# EAGLE schematic CapacitiveSoilMoistureSensor_v14 (EAGLE 9.7.0)
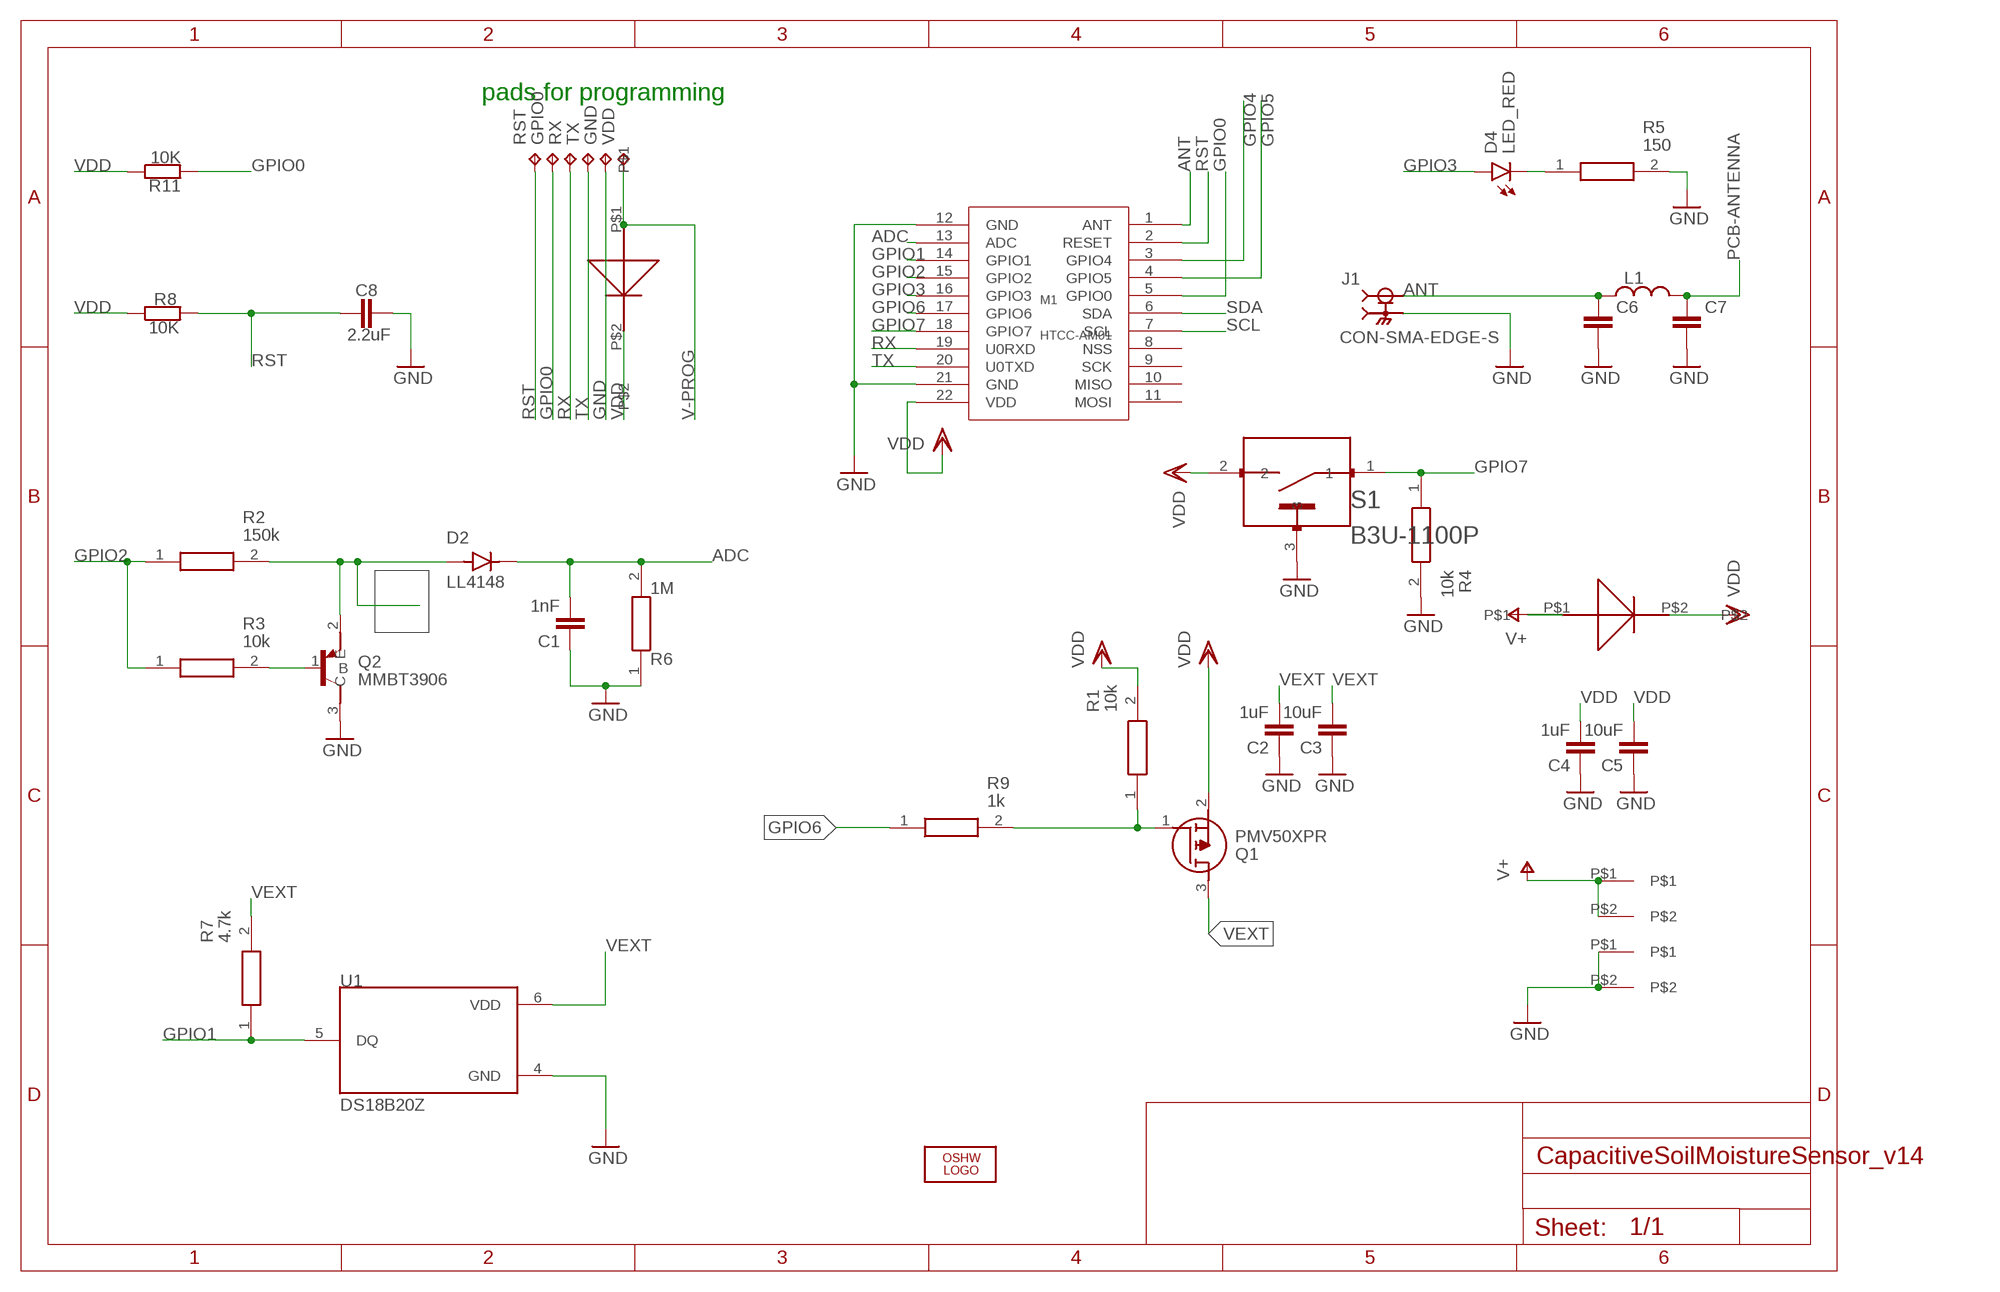
[diagram p0: schematic, sheet 1]

## Parts
C1  1nF  C-EUC0603  [C0603]
C2  1uF  C-EUC0603  [C0603]
C3  10uF  C-EUC0603  [C0603]
C4  1uF  C-EUC0603  [C0603]
C5  10uF  C-EUC0603  [C0603]
C6  C_CHIP-0603(1608-METRIC)  [CAPC1608X85]
C7  C_CHIP-0603(1608-METRIC)  [CAPC1608X85]
C8  2.2uF  C-EUC0603  [C0603]
D1  SOD-323  [SOD-323]
D2  LL4148  [DIO_LL4148]
D3  SOD-323  [SOD-323]
D4  LED_RED  CHIP-FLAT-R_0603-0.80MM  [LEDC1608X80N_FLAT-R]
GND  TPTP20SQ  [TP20SQ]
GPIO0  TPTP20SQ  [TP20SQ]
J1  CON-SMA-EDGE-S  [RFSOLUTIONS_CON-SMA-EDGE-S]
L1  L_CHIP-0603(1608-METRIC)  [INDC1608X95N]
LOGO1  LOGO-OSHW-FILLX0200-NT  [OSHW_FILLX200_NOTEXT]
M1  HTCC-AM01  [HTCC-AM01]
Q1  PMV50XPR  [SOT95P230X110-3N]
Q2  MMBT3906  [SOT95P240X120-3N]
R1  10k  CMP0603AFX-1002ELF  [RESC1608X55N]
R2  150k  RCA06031K00FKEAHP  [RESC1608X55N]
R3  10k  RCA06031K00FKEAHP  [RESC1608X55N]
R4  10k  CMP0603AFX-1002ELF  [RESC1608X55N]
R5  150  RCA06031K00FKEAHP  [RESC1608X55N]
R6  1M  CMP0603AFX-1002ELF  [RESC1608X55N]
R7  4.7k  CMP0603AFX-1002ELF  [RESC1608X55N]
R8  10K  R-EU_R0603  [R0603]
R9  1k  RCA06031K00FKEAHP  [RESC1608X55N]
R11  10K  R-EU_R0603  [R0603]
RST  TPTP20SQ  [TP20SQ]
RX  TPTP20SQ  [TP20SQ]
S1  B3U-1100P  [SW_B3U-1100P]
TX  TPTP20SQ  [TP20SQ]
U1  DS18B20Z  [SOIC127P600X175-8N]
U$3  KEYSTONE53  [KEYSTONE53]
U$4  KEYSTONE53  [KEYSTONE53]
VDD  TPTP20SQ  [TP20SQ]

## Nets
ADC: C1.2 D2.C M1.13(ADC) R6.2
ANT: C6.1 J1.1 L1.1 M1.1(ANT)
GND: C1.1 C2.1 C3.1 C4.1 C5.1 C6.2 C7.2 C8.1 GND.TP J1.G1 J1.G2 J1.G3 J1.G4 M1.12(GND) M1.21(GND) Q2.3(C) R4.2 R5.2 R6.1 S1.3 U1.4(GND) U$4.P$1 U$4.P$2
GPIO0: GPIO0.TP M1.5(GPIO0) R11.2
GPIO1: M1.14(GPIO1) R7.1 U1.5(DQ)
GPIO2: M1.15(GPIO2) R2.1 R3.1
GPIO3: D4.A M1.16(GPIO3)
GPIO4: M1.3(GPIO4)
GPIO5: M1.4(GPIO5)
GPIO6: M1.17(GPIO6) R9.1
GPIO7: M1.18(GPIO7) R4.1 S1.1
N$1: Q1.1(G) R1.1 R9.2
N$3: Q2.1(B) R3.2
N$4: D4.C R5.1
N$5: D2.A Q2.2(E) R2.2
PCB-ANTENNA: C7.1 L1.2
RST: C8.2 M1.2(RESET) R8.2 RST.TP
RX: M1.19(U0RXD) RX.TP
SCL: M1.7(SCL)
SDA: M1.6(SDA)
TX: M1.20(U0TXD) TX.TP
V+: D1.P$1 U$3.P$1 U$3.P$2
V-PROG: D3.P$1 VDD.TP
VDD: C4.2 C5.2 D1.P$2 D3.P$2 M1.22(VDD) Q1.2(S) R1.2 R8.1 R11.1 S1.2
VEXT: C2.2 C3.2 Q1.3(D) R7.2 U1.6(VDD)
Unconnected: M1.8(NSS) M1.9(SCK) M1.10(MISO) M1.11(MOSI)

## Notes on the sheet
- pads for programming

## Library data of the parts
C1-C5 C8 = rcl:C-EU: CAPACITOR, European symbol; SPICEPREFIX: C
C6 C7 = Capacitor:C: Capacitor - Generic; CATEGORY: Capacitor
D1 D3 = HTCC-AM01:SOD-323
D2 = SnapEDA Library:LL4148: Surface Mount Switching Glass; MANUFACTURER: On Semiconductor; MAXIMUM_PACKAGE_HEIGHT: 1.5mm; PARTREV: 1.8; STANDARD: Manufacturer recommendations
D4 = LED:CHIP-FLAT-R; CATEGORY: LED; COLOR: RED; DESCRIPTION: CHIP LED FLAT; SUB-CATEGORY: CHIP; TYPE: FLAT_TOP
GND GPIO0 RST RX TX VDD = testpad:TP: Test pad
J1 = CON-SMA-EDGE-S:CON-SMA-EDGE-S; MANUFACTURER: RF Solutions; MAXIMUM_PACKAGE_HEIGHT: 6.35mm; PARTREV: 1; STANDARD: Manufacturer Recommendations
L1 = Inductor:L: Inductor Fixed - Generic; CATEGORY: Inductor; SUB-CATEGORY: Fixed
LOGO1 = logo:LOGO-OSHW-FILL; PARTNO: DNP
M1 = HTCC-AM01:HTCC-AM01: No description set
Q1 = HTCC-AM01:PMV50XPR: NEXPERIA - PMV50XPR - MOSFET, P-CH, -20V, -3.6A, TO236AB-3 Source: Datasheet <http://assets.nexperia.com/documents/data-sheet/PMV50XP.pdf>; DESCRIPTION: NEXPERIA - PMV50XPR - MOSFET, P-CH, -20V, -3.6A, TO236AB-3; HEIGHT: 1.1mm; MANUFACTURER_NAME: Nexperia; MANUFACTURER_PART_NUMBER: PMV50XPR; MOUSER_PART_NUMBER: 771-PMV50XPR; MOUSER_PRICE-STOCK: https://www.mouser.co.uk/ProductDetail/Nexperia/PMV50XPR?qs=%252BRKXB2WKlSc7VldGLKM90g%3D%3D
Q2 = SnapEDA Library:MMBT3906: MMBT3906 Series 40 V CE Breakdown 0.2 A PNP General Purpose Amplifier - SOT-23; MANUFACTURER: Fairchild Semiconductor
R1 R4 R6 R7 = HTCC-AM01:CMP0603AFX-1002ELF: Thick Film Resistors - SMD 10K OHM 1% 1/4W TC100 Source: Datasheet <https://www.bourns.com/docs/Product-Datasheets/CMP-A.pdf>; DESCRIPTION: Thick Film Resistors - SMD 10K OHM 1% 1/4W TC100; HEIGHT: 0.55mm; MANUFACTURER_NAME: Bourns; MANUFACTURER_PART_NUMBER: CMP0603AFX-1002ELF; MOUSER_PART_NUMBER: 652-CMP0603AFX-1002L; MOUSER_PRICE-STOCK: https://www.mouser.co.uk/ProductDetail/Bourns/CMP0603AFX-1002ELF?qs=TiOZkKH1s2Q14lKL9rbzLg%3D%3D
R2 R3 R5 R9 = HTCC-AM01:RCA06031K00FKEAHP
R8 R11 = rcl:R-EU_: RESISTOR, European symbol; SPICEPREFIX: R
S1 = SnapEDA Library:B3U-1100P: Ultra-small Surface-mounting Tactile Switches with High Contact Reliability; MANUFACTURER: Omron
U1 = DS18B20Z-FLIP:DS18B20Z: DALLAS - DALLAS DS18B20Z High-Precision 1-Wire Digital Thermometer; MANUFACTURER: Maxim Integrated; PARTREV: 5; STANDARD: IPC7351B
U$3 U$4 = domsensorv06:KEYSTONE53